# Altium schematic sheet USB_Audio.SchDoc
size A; DrawnBy: KEW; Revision: X1; SheetNumber: 5; SheetTotal: 11; RevisionDate: 9/6/2024; RevisionDescription: First Rev; RevisionEngineer: KEW; ProjectTitle: Front USB-Audio; CompanyName: Gamber-Johnson LLC; Organization: CD Cell; Application_BuildNumber: TBD
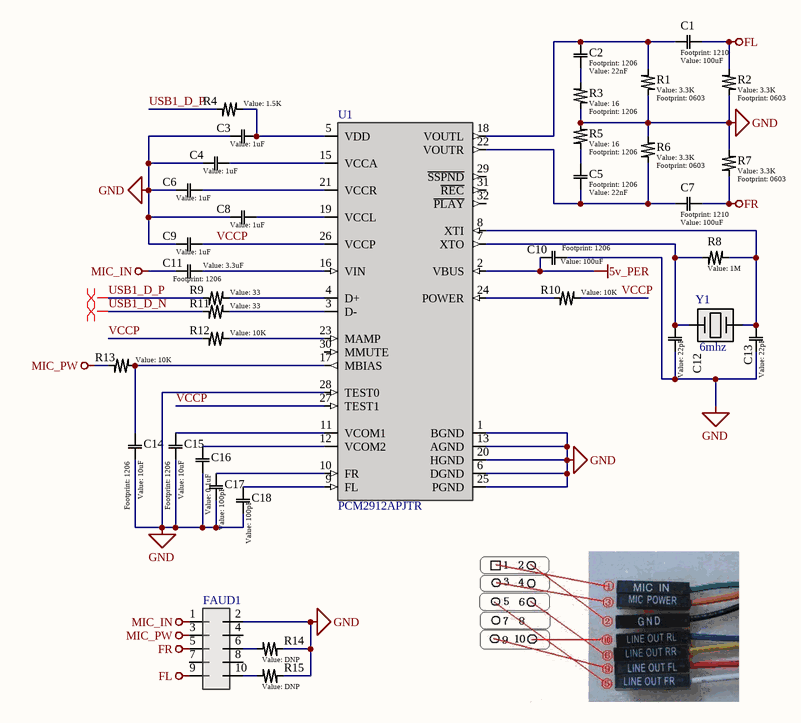
[diagram p0: USB_Audio.SchDoc]

## Parts
C1  value 100uF  [1210]  (hidden comment: Generic Capacitor)
C2  value 22nF  [1206]  (hidden comment: Generic Capacitor)
C3  value 1uF  [0603]  (hidden comment: Generic Capacitor)
C4  value 1uF  [0603]  (hidden comment: Generic Capacitor)
C5  value 22nF  [1206]  (hidden comment: Generic Capacitor)
C6  value 1uF  [0603]  (hidden comment: Generic Capacitor)
C7  value 100uF  [1210]  (hidden comment: Generic Capacitor)
C8  value 1uF  [0603]  (hidden comment: Generic Capacitor)
C9  value 1uF  [0603]  (hidden comment: Generic Capacitor)
C10  value 100uF  [1206]  (hidden comment: Generic Capacitor)
C11  value 3.3uF  [1206]  (hidden comment: Generic Capacitor)
C12  value 22pF  [0603]  (hidden comment: Generic Capacitor)
C13  value 22pF  [0603]  (hidden comment: Generic Capacitor)
C14  value 10uF  [1206]  (hidden comment: Generic Capacitor)
C15  value 10uF  [1206]  (hidden comment: Generic Capacitor)
C16  value 0.1uF  [0603]  (hidden comment: Generic Capacitor)
C17  value 100pF  [0603]  (hidden comment: Generic Capacitor)
C18  value 100pF  [0603]  (hidden comment: Generic Capacitor)
FAUD1  10pinMobo  [10pinMobo]  (value not drawn)
R1  value 3.3K  [0603]  (hidden comment: Generic Resistor)
R2  value 3.3K  [0603]  (hidden comment: Generic Resistor)
R3  value 16  [1206]  (hidden comment: Generic Resistor)
R4  value 1.5K  [0603]  (hidden comment: Generic Resistor)
R5  value 16  [1206]  (hidden comment: Generic Resistor)
R6  value 3.3K  [0603]  (hidden comment: Generic Resistor)
R7  value 3.3K  [0603]  (hidden comment: Generic Resistor)
R8  value 1M  [0603]  (hidden comment: Generic Resistor)
R9  value 33  [0603]  (hidden comment: Generic Resistor)
R10  value 10K  [0603]  (hidden comment: Generic Resistor)
R11  value 33  [0603]  (hidden comment: Generic Resistor)
R12  value 10K  [0603]  (hidden comment: Generic Resistor)
R13  value 10K  [0603]  (hidden comment: Generic Resistor)
R14  value DNP  [0603]  (hidden comment: Generic Resistor)
R15  value DNP  [0603]  (hidden comment: Generic Resistor)
U1  PCM2912APJTR  [32-TQFP]
Y1  6mhz  [HC-49S-SMD]

## Nets
5v_PER: C10.1 U1.2(VBUS)
FL: C1.1 FAUD1.9 R2.2
FR: C7.1 FAUD1.5 R7.2
GND: C3.1 C4.1 C6.1 C8.1 C9.1 C10.2 C12.2 C13.2 C14.2 C15.2 C16.2 C17.2 C18.2 FAUD1.2 R1.1 R2.1 R3.1 R5.1 R6.1 R7.1 R14.1 R15.1 U1.1(BGND) U1.6(DGND) U1.13(AGND) U1.20(HGND) U1.25(PGND) U1.28(TEST0)
MIC_IN: C11.2 FAUD1.1
MIC_PW: FAUD1.3 R13.2
USB1_D_N: R11.2
USB1_D_P: R4.2 R9.2
VCCP: C9.2 R10.1 R12.2 U1.26(VCCP) U1.27(TEST1)
NetC1_2: C1.2 C2.1 R1.2 U1.18(VOUTL)
NetC2_2: C2.2 R3.2
NetC3_2: C3.2 R4.1 U1.5(VDD)
NetC4_2: C4.2 U1.15(VCCA)
NetC5_1: C5.1 C7.2 R6.2 U1.22(VOUTR)
NetC5_2: C5.2 R5.2
NetC6_2: C6.2 U1.21(VCCR)
NetC8_2: C8.2 U1.19(VCCL)
NetC11_1: C11.1 U1.16(VIN)
NetC12_1: C12.1 R8.1 U1.7(XTO) Y1.1
NetC13_1: C13.1 R8.2 U1.8(XTI) Y1.2
NetC14_1: C14.1 R13.1 U1.17(MBIAS)
NetC15_1: C15.1 U1.11(VCOM1)
NetC16_1: C16.1 U1.12(VCOM2)
NetC17_1: C17.1 U1.10(FR)
NetC18_1: C18.1 U1.9(FL)
NetFAUD1_6: FAUD1.6 R14.2
NetFAUD1_10: FAUD1.10 R15.2
NetR9_1: R9.1 U1.4(D+)
NetR10_2: R10.2 U1.24(POWER)
NetR11_1: R11.1 U1.3(D-)
NetR12_1: R12.1 U1.23(MAMP)

Not connected (* = marked no-connect by the designer): FAUD1 4 7 8; U1 29(~{SSPND}) 30(MMUTE) 31(~{REC}) 32(~{PLAY})

## Layout directives
differential pair: USB1_D_N, USB1_D_P

## Notes on the sheet
- REV
- REVISIONS
- DATE
- DESCRIPTION
- BY
- UNLESS OTHERWISE SPECIFIED, DRAWING DEFINITIONS AND TOLERANCES SHALL BE FOUND UNDER SUPPLIER STANDARDS SS-001. THIS PART AND ALL COMPONENTS OF IT MUST BE RoHS & REACH COMPLIANT. A CERTIFICATE OF COMPLIANCE MUST BE PROVIDED UPON REQUEST.
- ALL INFORMATION ON THIS DOCUMENT IS THE SOLE PROPERTY OF GAMBER-JOHNSON AND SHALL NOT BE COPIED, REPRODUCED, USED OR DISCLOSED IN WHOLE OR IN PART WITHOUT THE WRITTEN CONSENT OF GAMBER-JOHNSON
- TOLERANCES
  .00 ± .060
  .000 ± .020
  .0000 ± .005
  ANGELS ± 1°
- DRAWN BY:
- PROJECT NUMBER:
- SHEET TITLE:
- SHEET
- OF
- DATE:
- LOCATION:
- ASSEMBLY NUMBER
- SIZE
- GAMBER-JOHNSON LLC
  5001 Joerns Dr
  STEVENS POINT, WI 54481
  +1 (715) 344-5209
- A

## Library data of the parts
C1-C18 = Generic Capacitor: Voltage: >10V; Tolerance: 10%
FAUD1 = 10pinMobo: 10pin motherboard jack
R1-R15 = Generic Resistor: Tolerance: 1%; Power: 1/10W
U1 = PCM2912APJTR: Audio CODEC with USB Interface, Mono Microphone Input and Stereo Headphone Output 32-TQFP -25 to 85; MF: Texas Instruments; MP: PCM2912APJTR; Price: None; DigiKey-Purchase-URL: https://snapeda.com/shop?store=DigiKey&id=574055; Package: TQFP-32 Texas Instruments; Texas_Instruments-Purchase-URL: https://snapeda.com/shop?store=Texas+Instruments&id=574055; Value: *; Availability: Unavailable; Mouser-Purchase-URL: https://snapeda.com/shop?store=Mouser&id=574055; SnapEDA_Link: https://www.snapeda.com/parts/PCM2912APJTR/Texas%20Instruments/view-part/574055/?ref=snap; LCSC PN: C475497
Y1 = H6OEL89CSC-SUGYLC-6M: 6MHz Surface Mount Crystal 20pF ±20ppm ±30ppm HC-49S-SMD Crystals; LCSC PN: C7528811